# EAGLE design First (EAGLE 7.2.0)
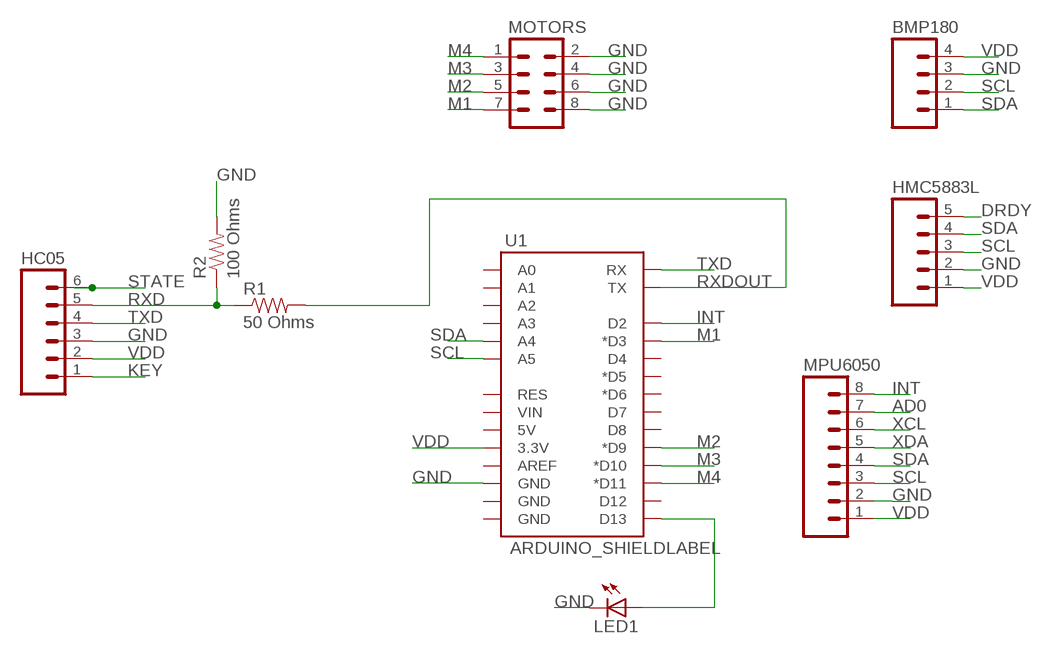
[diagram p0: schematic, sheet 1]

## Parts
BMP180  M04PTH  [1X04]
HC05  M06NO_SILK_FEMALE_PTH  [1X06_NO_SILK]
HMC5883L  M05_ROUNDONLY_NOSILK  [1X05_ROUNDONLY_NOSILK]
LED1  LED5MM  [LED5MM]
MOTORS  M04X2  [2X4]
MPU6050  M08NO_SILK  [1X08_PIN1_NO_SILK]
R1  50 Ohms  SPARKFUN_RESISTORAXIAL-0.3  [SPARKFUN_AXIAL-0.3]
R2  100 Ohms  SPARKFUN_RESISTORAXIAL-0.3  [SPARKFUN_AXIAL-0.3]
U1  ARDUINO_SHIELDLABEL  [DUEMILANOVE_SHIELD]

## Nets
AD0: MPU6050.7
DRDY: HMC5883L.5
GND: BMP180.3 HC05.3 HMC5883L.2 LED1.K(C) MOTORS.2 MOTORS.4 MOTORS.6 MOTORS.8 MPU6050.2 R2.P$2 U1.GND@2(GND)
INT: MPU6050.8 U1.D2
KEY: HC05.1
M1: MOTORS.7 U1.D3(*D3)
M2: MOTORS.5 U1.D9(*D9)
M3: MOTORS.3 U1.D10(*D10)
M4: MOTORS.1 U1.D11(*D11)
N$1: LED1.A U1.D13
RXD: HC05.5 R1.P$1 R2.P$1
RXDOUT: R1.P$2 U1.TX
SCL: BMP180.2 HMC5883L.3 MPU6050.3 U1.A5
SDA: BMP180.1 HMC5883L.4 MPU6050.4 U1.A4
STATE: HC05.6
TXD: HC05.4 U1.RX
VDD: BMP180.4 HC05.2 HMC5883L.1 MPU6050.1 U1.3.3V
XCL: MPU6050.6
XDA: MPU6050.5
Unconnected: U1.5V U1.A0 U1.A1 U1.A2 U1.A3 U1.AREF U1.D4 U1.D5(*D5) U1.D6(*D6) U1.D7 U1.D8 U1.D12 U1.GND@0(GND) U1.GND@1(GND) U1.RES U1.VIN

## Library data of the parts
BMP180 = SparkFun:M04: Header 4 Standard 4-pin 0.1" header. Use with straight break away headers (SKU : PRT-00116), right angle break away headers (PRT-00553), swiss pins (PRT-00743), machine pins (PRT-00117), and female headers (PRT-00115). Molex polarized connector foot print use with SKU : PRT-08231 with associated crimp pins and housings. 1MM SMD Version SKU: PRT-10208
HC05 = SparkFun-Connectors:M06: Header 6 Standard 6-pin 0.1" header. Use with straight break away headers (SKU : PRT-00116), right angle break away headers (PRT-00553), swiss pins (PRT-00743), machine pins (PRT-00117), and female headers (PRT-00115). Molex polarized connector foot print use with SKU : PRT-08094 with associated crimp pins and housings. NOTES ON THE VARIANTS LOCK and LOCK_LONGPADS... This footprint was designed to help hold the alignment of a through-hole component (i.e. 6-pin header) while soldering it into place. You may notice that each hole has been shifted either up or down by 0.005 of an inch from it's more standard position (which is a perfectly straight line). This slight alteration caused the pins (the squares in the middle) to touch the edges of the holes. Because they are alternating, it causes a "brace" to hold the component in place. 0.005 has proven to be the perfect amount of "off-center" position when using our standard breakaway headers. Although looks a little odd when you look at the bare footprint, once you have a header in there, the alteration is very hard to notice. Also,if you push a header all the way into place, it is covered up entirely on the bottom side. This idea of altering the position of holes to aid alignment will be further integrated into the Sparkfun Library for other footprints. It can help hold any component with 3 or more connection pins.; PROD_ID: CONN-08437
HMC5883L = mike-temp:M05: Header 5 Standard 5-pin 0.1" header. Use with straight break away headers (SKU : PRT-00116), right angle break away headers (PRT-00553), swiss pins (PRT-00743), machine pins (PRT-00117), and female headers (PRT-00115). Molex polarized connector foot print use with SKU : PRT-08230 with associated crimp pins and housings.
LED1 = led:LED: LED OSRAM: - CHIPLED LG R971, LG N971, LY N971, LG Q971, LY Q971, LO R971, LY R971 LH N974, LH R974 LS Q976, LO Q976, LY Q976 LO Q996 - Hyper CHIPLED LW Q18S LB Q993, LB Q99A, LB R99A - SideLED LS A670, LO A670, LY A670, LG A670, LP A670 LB A673, LV A673, LT A673, LW A673 LH A674 LY A675 LS A676, LA A676, LO A676, LY A676, LW A676 LS A679, LY A679, LG A679 - Hyper Micro SIDELED® LS Y876, LA Y876, LO Y876, LY Y876 LT Y87S - SmartLED LW L88C, LW L88S LB L89C, LB L89S, LG L890 LS L89K, LO L89K, LY L89K LS L896, LA L896, LO L896, LY L896 - TOPLED LS T670, LO T670, LY T670, LG T670, LP T670 LSG T670, LSP T670, LSY T670, LOP T670, LYG T670 LG T671, LOG T671, LSG T671 LB T673, LV T673, LT T673, LW T673 LH T674 LS T676, LA T676, LO T676, LY T676, LB T676, LH T676, LSB T676, LW T676 LB T67C, LV T67C, LT T67C, LS T67K, LO T67K, LY T67K, LW E67C LS E67B, LA E67B, LO E67B, LY E67B, LB E67C, LV E67C, LT E67C LW T67C LS T679, LY T679, LG T679 LS T770, LO T770, LY T770, LG T770, LP T770 LB T773, LV T773, LT T773, LW T773 LH T774 LS E675, LA E675, LY E675, LS T675 LS T776, LA T776, LO T776, LY T776, LB T776 LHGB T686 LT T68C, LB T68C - Hyper Mini TOPLED® LB M676 - Mini TOPLED Santana® LG M470 LS M47K, LO M47K, LY M47K Source: http://www.osram.convergy.de LUXEON: - LUMILED® LXK2-PW12-R00, LXK2-PW12-S00, LXK2-PW14-U00, LXK2-PW14-V00 LXK2-PM12-R00, LXK2-PM12-S00, LXK2-PM14-U00 LXK2-PE12-Q00, LXK2-PE12-R00, LXK2-PE12-S00, LXK2-PE14-T00, LXK2-PE14-U00 LXK2-PB12-K00, LXK2-PB12-L00, LXK2-PB12-M00, LXK2-PB14-N00, LXK2-PB14-P00, LXK2-PB14-Q00 LXK2-PR12-L00, LXK2-PR12-M00, LXK2-PR14-Q00, LXK2-PR14-R00 LXK2-PD12-Q00, LXK2-PD12-R00, LXK2-PD12-S00 LXK2-PH12-R00, LXK2-PH12-S00 LXK2-PL12-P00, LXK2-PL12-Q00, LXK2-PL12-R00 Source: www.luxeon.com KINGBRIGHT: KA-3528ASYC Source: www.kingbright.com
MOTORS = SparkFun-Connectors:M04X2: .1" header, two rows of four.
MPU6050 = SparkFun-Connectors:M08: Header 8 Standard 8-pin 0.1" header. Use with straight break away headers (SKU : PRT-00116), right angle break away headers (PRT-00553), swiss pins (PRT-00743), machine pins (PRT-00117), and female headers (PRT-00115).
R1 R2 = Triple_Axis_Accelerometer_-_Gyro_Breakout_-_MPU-6050:SPARKFUN_RESISTOR: Resistor Basic schematic elements and footprints for 0603, 1206, and PTH resistors.
U1 = SparkFun-Boards:ARDUINO_SHIELD: Arduino shield footprint

## Net classes
0 Default: width 0.203 mm

## Board
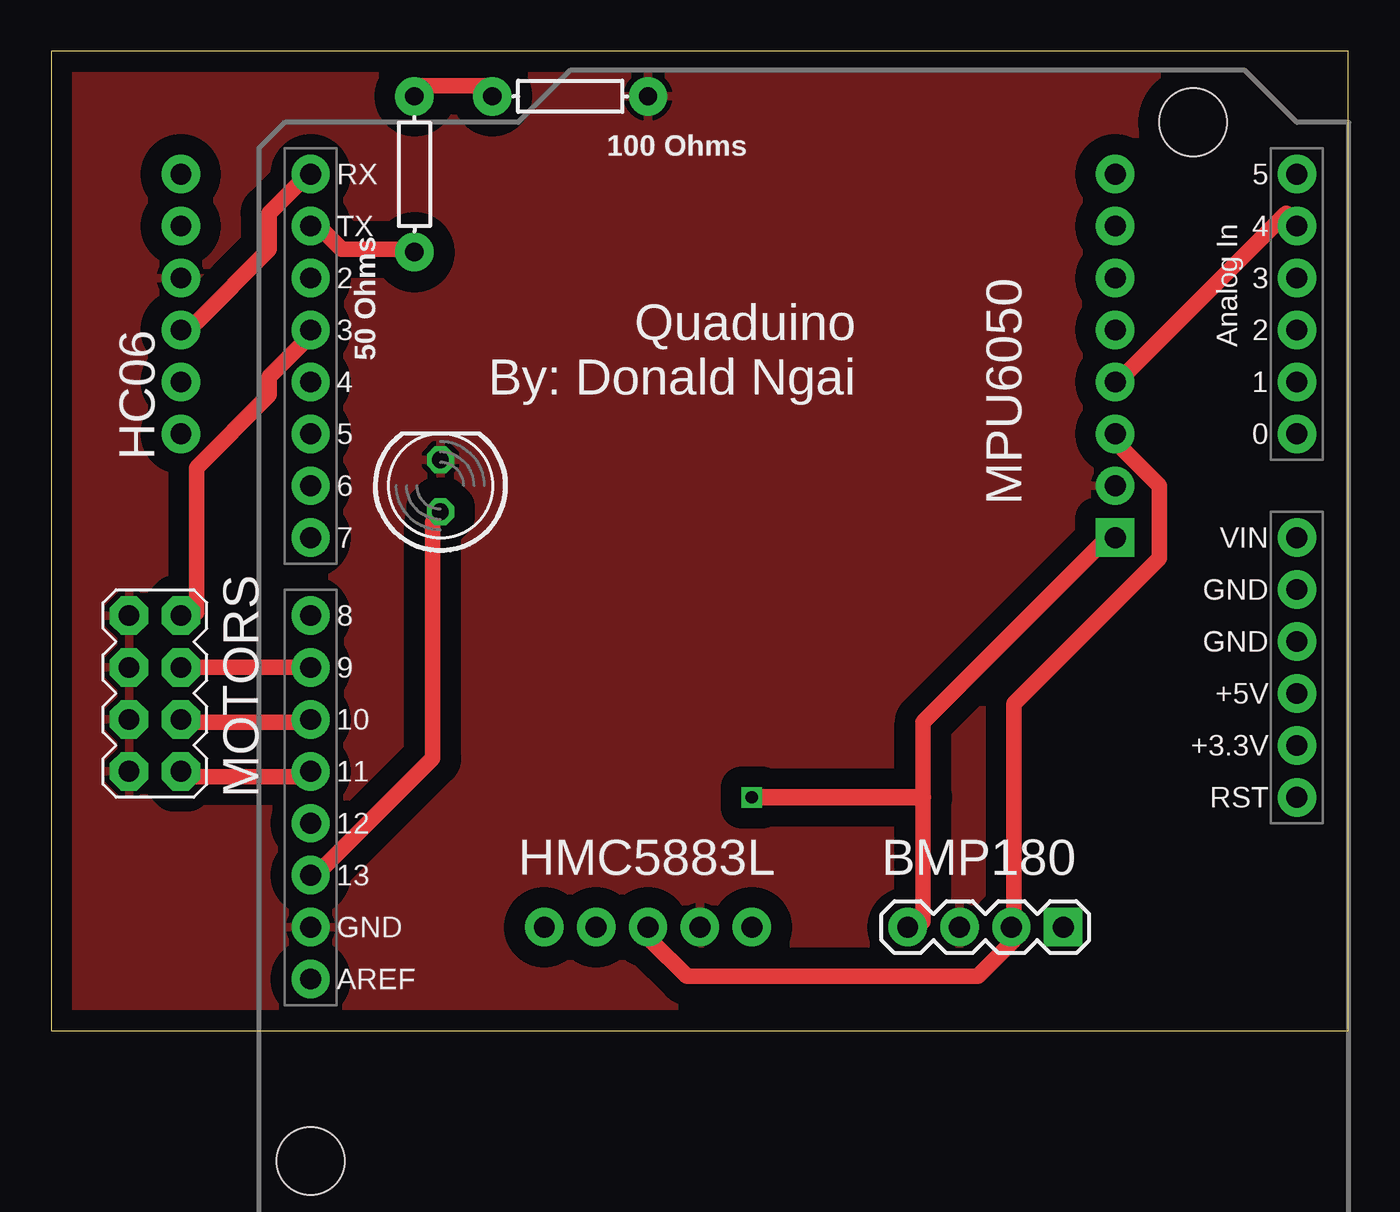
[diagram p1: board, top side]
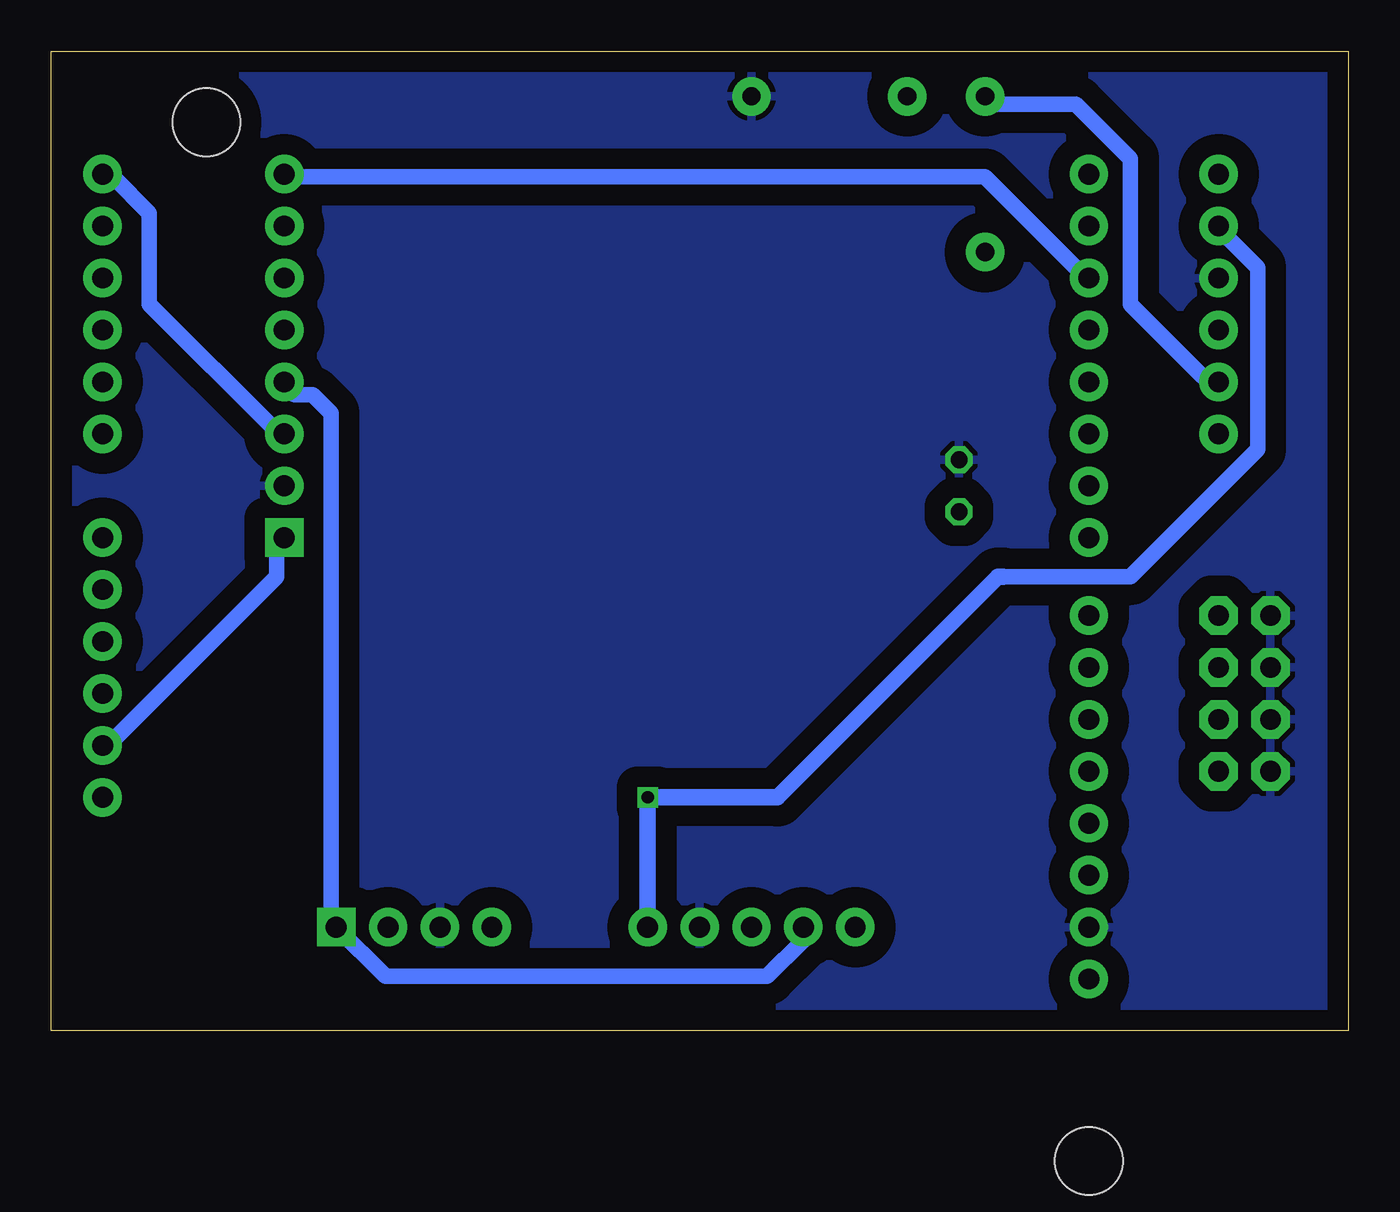
[diagram p2: board, bottom side, seen from below]

Size 63.48 x 47.93 mm. Coordinates in mm from the lower left corner, seen from the top.
Outline: 0,0 63.48,0 63.48,47.93 0,47.93 0,0
Copper layers (1*16): Top 0.035mm / dielectric 1.5mm / Bottom 0.035mm
Design rules "default *": minimum track width 30mil, minimum drill 24mil, track to track 40mil, track to pad 8mil, pad to pad 8mil, via to via 8mil, smd to smd 8mil, copper to edge 40mil, drill to drill 8mil, minimum pad ring 10mil, minimum via ring 8mil, stop-mask expansion 4mil, vias tented up to drill 0mil, thermal gap 10mil

### Footprints (pad centres in the part's own frame; a part is rotated, then mirrored left to right if it is on the bottom)
1X04 = drill 1.016 pad 1.88 square: 1 0,0 | drill 1.016 pad 1.88: 2 2.54,0; 3 5.08,0; 4 7.62,0
1X06_NO_SILK = drill 1.016 pad 1.88: 1 0,0; 2 2.54,0; 3 5.08,0; 4 7.62,0; 5 10.16,0; 6 12.7,0
1X05_ROUNDONLY_NOSILK = drill 1.016 pad 1.88: 1 0,0; 2 2.54,0; 3 5.08,0; 4 7.62,0; 5 10.16,0
LED5MM = drill 0.813 octagon: A -1.27,0; K 1.27,0
2X4 = drill 1.016 pad 1.88 octagon: 1 -3.81,-1.27; 2 -3.81,1.27; 3 -1.27,-1.27; 4 -1.27,1.27; 5 1.27,-1.27; 6 1.27,1.27; 7 3.81,-1.27; 8 3.81,1.27
1X08_PIN1_NO_SILK = drill 1.016 pad 1.88 square: 1 0,0 | drill 1.016 pad 1.88: 2 2.54,0; 3 5.08,0; 4 7.62,0; 5 10.16,0; 6 12.7,0; 7 15.24,0; 8 17.78,0
SPARKFUN_AXIAL-0.3 = drill 0.9 pad 1.88: P$1 -3.81,0; P$2 3.81,0
DUEMILANOVE_SHIELD = drill 1.016 pad 1.88: 3.3V 50.8,26.67; 5V 50.8,29.21; A0 50.8,41.91; A1 50.8,44.45; A2 50.8,46.99; A3 50.8,49.53; A4 50.8,52.07; A5 50.8,54.61; AREF 2.54,15.24; D2 2.54,49.53; D3 2.54,46.99; D4 2.54,44.45; D5 2.54,41.91; D6 2.54,39.37; D7 2.54,36.83; D8 2.54,33.02; D9 2.54,30.48; D10 2.54,27.94; D11 2.54,25.4; D12 2.54,22.86; D13 2.54,20.32; GND@0 50.8,31.75; GND@1 50.8,34.29; GND@2 2.54,17.78; RES 50.8,24.13; RX 2.54,54.61; TX 2.54,52.07; VIN 50.8,36.83 | hole 3.302: 45.72,57.15; 2.54,6.35

### Placement (x,y rotation side)
BMP180  49.53,5.08 180 top
HC05  6.35,41.91 270 top
HMC5883L  34.29,5.08 180 top
LED1  19.05,26.67 90 top
MOTORS  5.08,16.51 90 top
MPU6050  52.07,24.13 90 top
R1  17.78,41.91 270 top
R2  25.4,45.72 0 top
U1  10.16,-12.7 0 top

### Tracks (layer width: path | path; a pad name or v marks a point on that pad's centre or on a via)
GND
  pour Top (isolate 0.61): -1.27,49.53 64.77,49.53 64.77,-1.27 -1.27,-1.27
  pour Bottom (isolate 0.61): -1.27,49.53 64.77,49.53 64.77,-1.27 -1.27,-1.27
INT
  Bottom 0.762: U1.D2 13.34,37.34 17.78,41.78 51.56,41.78 MPU6050.8
M1
  Top 0.762: MOTORS.7 7.11,20.45 7.11,27.56 10.67,31.11 10.67,32 12.45,33.78 U1.D3
M2
  Top 0.762: U1.D9 MOTORS.5
M3
  Top 0.762: MOTORS.3 7.11,15.11 12.45,15.11 U1.D10
M4
  Top 0.762: MOTORS.1 7.11,12.45 12.45,12.45 U1.D11
N$1
  Top 0.762: LED1.A 18.67,24.89 18.67,13.34 13.34,8 U1.D13
RXD
  Top 0.762: R2.P$1 21.34,46.23 17.78,46.23 R1.P$1
  Bottom 0.762: HC05.5 7.11,32 10.67,35.56 10.67,42.67 13.34,45.34 17.78,45.34 R1.P$1
RXDOUT
  Top 0.762: R1.P$2 17.78,38.23 14.22,38.23 13.34,39.12 U1.TX
SCL
  Top 0.762: HMC5883L.3 29.34,4.45 31.11,2.67 45.34,2.67 47.12,4.45 BMP180.2 47.12,5.33 47.12,16 54.23,23.11 54.23,26.67 52.45,28.45 MPU6050.3
  Bottom 0.762: MPU6050.3 52.45,29.34 58.67,35.56 58.67,40.01 60.45,41.78 U1.A5
SDA
  Top 0.762: MPU6050.4 52.45,32 60.45,40.01 U1.A4
  Bottom 0.762: HMC5883L.4 26.67,4.45 28.45,2.67 47.12,2.67 BMP180.1 49.78,5.33 49.78,30.23 50.67,31.11 51.56,31.11 MPU6050.4
TXD
  Top 0.762: HC05.4 7.11,34.67 10.67,38.23 10.67,40.01 12.45,41.78 U1.RX
VDD  (via drill 0.6)
  Top 0.762: MPU6050.1 51.56,24 42.67,15.11 42.67,11.43 42.67,5.33 BMP180.4
  Top 0.813: v34.29,11.43 42.67,11.43
  Bottom 0.762: U1.3.3V 60.45,14.22 52.45,22.23 52.45,24 MPU6050.1 | 16.89,22.23 10.67,22.23 4.45,28.45 4.45,37.34 6.22,39.12 HC05.2
  Bottom 0.813: 16.89,22.23 17.14,22.23 27.94,11.43 v34.29,11.43 HMC5883L.1

### Text on the board
tPlace: MPU6050 | Quaduino / By: Donald Ngai | HC06 | MOTORS | HMC5883L | BMP180